# EAGLE design polivoks ambika (EAGLE 6.3)
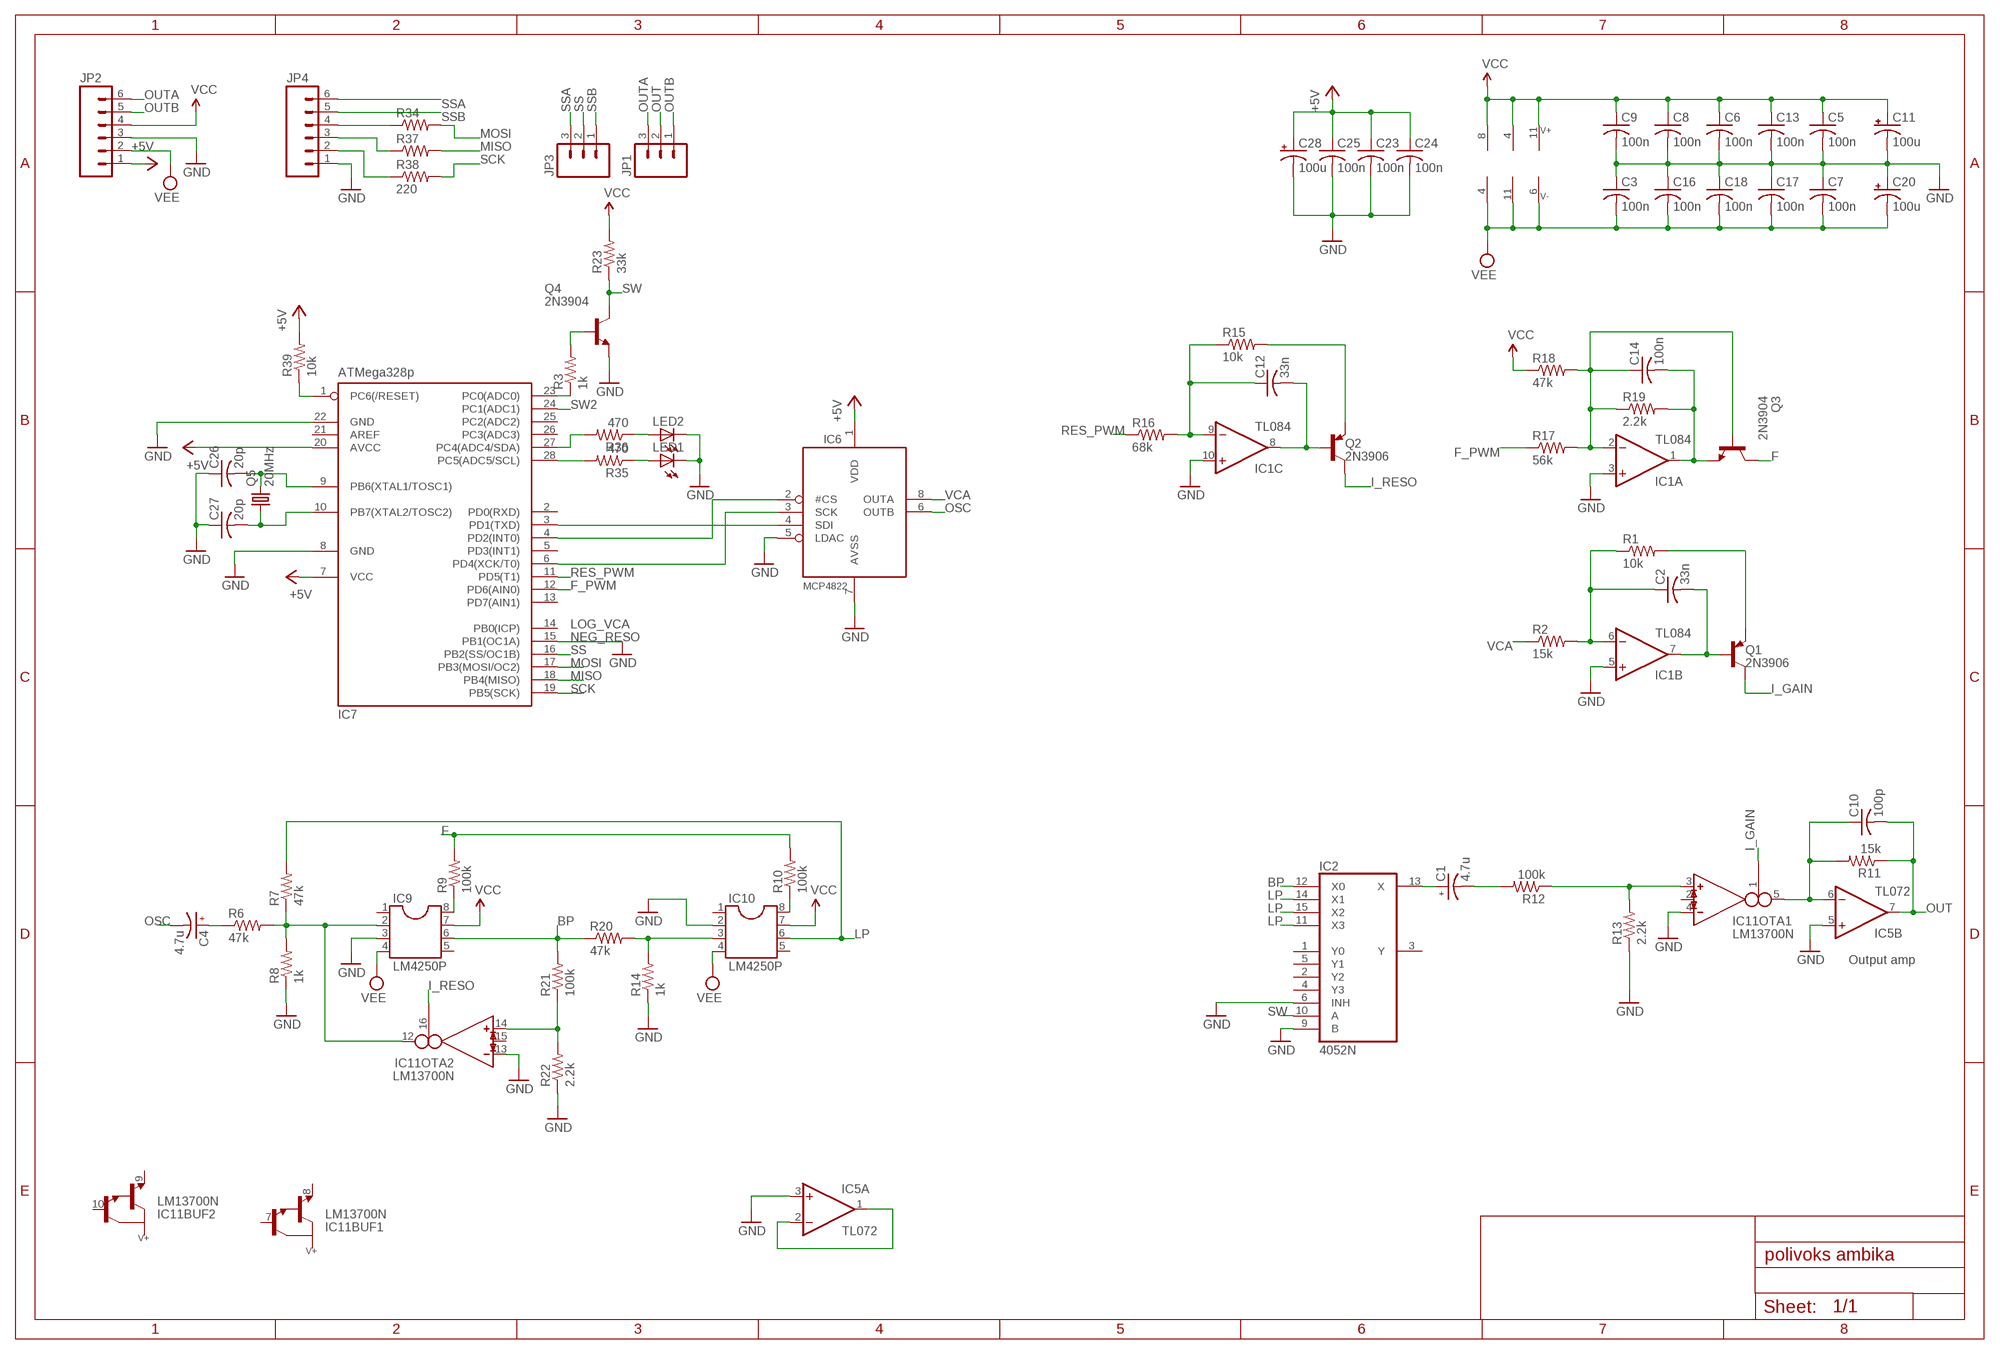
[diagram p0: schematic, sheet 1]

## Parts
C1  4.7u  CPOL-USE11-6.3  [E11-6.3]
C2  33n  C-US050-025X075  [C050-025X075]
C3  100n  C-US025-025X050  [C025-025X050]
C4  4.7u  CPOL-USE11-6.3  [E11-6.3]
C5  100n  C-US025-025X050  [C025-025X050]
C6  100n  C-US025-025X050  [C025-025X050]
C7  100n  C-US025-025X050  [C025-025X050]
C8  100n  C-US025-025X050  [C025-025X050]
C9  100n  C-US025-025X050  [C025-025X050]
C10  100p  C-US025-025X050  [C025-025X050]
C11  100u  CPOL-USE2.5-6  [E2,5-6]
C12  33n  C-US050-025X075  [C050-025X075]
C13  100n  C-US025-025X050  [C025-025X050]
C14  100n  C-US025-025X050  [C025-025X050]
C16  100n  C-US025-025X050  [C025-025X050]
C17  100n  C-US025-025X050  [C025-025X050]
C18  100n  C-US025-025X050  [C025-025X050]
C20  100u  CPOL-USE2.5-6  [E2,5-6]
C23  100n  C-US025-025X050  [C025-025X050]
C24  100n  C-US025-025X050  [C025-025X050]
C25  100n  C-US025-025X050  [C025-025X050]
C26  20p  C-US025-024X044  [C025-024X044]
C27  20p  C-US025-024X044  [C025-024X044]
C28  100u  CPOL-USE2.5-6  [E2,5-6]
IC1  TL084  TL084P  [DIL14]
IC2  4052N  [DIL16]
IC5  TL072  TL082P  [DIL08]
IC6  MCP4822  [DIL08]
IC7  ATMega328p  MEGA8-P  [DIL28-3]
IC9  LM4250P  DIL8  [DIL08]
IC10  LM4250P  DIL8  [DIL08]
IC11  LM13700N  [DIL16]
JP1  M03PTH  [1X03]
JP2  M06SIP  [1X06]
JP3  M03PTH  [1X03]
JP4  M06SIP  [1X06]
LED1  LED3MM  [LED3MM]
LED2  LED3MM  [LED3MM]
Q1  2N3906  2N3906-  [TO92-]
Q2  2N3906  2N3906-  [TO92-]
Q3  2N3904  [TO92]
Q4  2N3904  [TO92]
Q5  20MHz  CRYSTALHC49U-V  [HC49U-V]
R1  10k  R-US_0204/7  [0204/7]
R2  15k  R-US_0204/7  [0204/7]
R3  1k  R-US_0204/7  [0204/7]
R6  47k  R-US_0204/7  [0204/7]
R7  47k  R-US_0204/7  [0204/7]
R8  1k  R-US_0204/7  [0204/7]
R9  100k  R-US_0204/7  [0204/7]
R10  100k  R-US_0204/7  [0204/7]
R11  15k  R-US_0204/7  [0204/7]
R12  100k  R-US_0204/7  [0204/7]
R13  2.2k  R-US_0204/7  [0204/7]
R14  1k  R-US_0204/7  [0204/7]
R15  10k  R-US_0204/7  [0204/7]
R16  68k  R-US_0204/7  [0204/7]
R17  56k  R-US_0204/7  [0204/7]
R18  47k  R-US_0204/7  [0204/7]
R19  2.2k  R-US_0204/7  [0204/7]
R20  47k  R-US_0204/7  [0204/7]
R21  100k  R-US_0204/7  [0204/7]
R22  2.2k  R-US_0204/7  [0204/7]
R23  33k  R-US_0204/7  [0204/7]
R34  220  R-US_0204/7  [0204/7]
R35  470  R-US_0204/7  [0204/7]
R36  470  R-US_0204/7  [0204/7]
R37  220  R-US_0204/7  [0204/7]
R38  220  R-US_0204/7  [0204/7]
R39  10k  R-US_0204/7  [0204/7]

## Nets
+5V: C23.1 C24.1 C25.1 C28.+ IC6.1(VDD) IC7.7(VCC) IC7.20(AVCC) JP2.1 R39.2
BP: IC2.12(X0) IC9.6 R20.1 R21.2
F: Q3.1(C) R9.2 R10.2
F_PWM: IC7.12(PD6(AIN0)) R17.1
GND: C3.1 C5.2 C6.2 C7.1 C8.2 C9.2 C11.- C13.2 C16.1 C17.1 C18.1 C20.+ C23.2 C24.2 C25.2 C26.1 C27.1 C28.- IC1.3(A:+IN) IC1.5(B:+IN) IC1.10(C:+IN) IC2.6(INH) IC2.9(B) IC5.3(A:+IN) IC5.5(B:+IN) IC6.5(LDAC) IC6.7(AVSS) IC7.8(GND) IC7.15(PB1(OC1A)) IC7.22(GND) IC9.3 IC10.2 IC11.4(OTA1:IN_N) IC11.13(OTA2:IN_N) JP2.3 JP4.1 LED1.K(C) LED2.K(C) Q4.3(E) R8.1 R13.1 R14.1 R22.1
I_GAIN: IC11.1(OTA1:I_BIAS) Q1.1(C)
I_RESO: IC11.16(OTA2:I_BIAS) Q2.1(C)
LP: IC2.11(X3) IC2.14(X1) IC2.15(X2) IC10.6 R7.2
MISO: IC7.18(PB4(MISO)) R37.2
MOSI: IC7.17(PB3(MOSI/OC2)) R34.2
N$1: IC9.2 IC11.12(OTA2:OUT) R6.2 R7.1 R8.2
N$2: C14.2 IC1.1(A:OUT) Q3.3(E) R19.2
N$3: IC6.4(SDI) IC7.3(PD1(TXD))
N$4: C4.+ R6.1
N$5: C1.+ IC2.13(X)
N$6: IC10.3 R14.2 R20.2
N$7: LED1.A R35.1
N$8: JP4.2 R38.1
N$9: IC9.8 R9.1
N$10: LED2.A R36.1
N$11: IC7.27(PC4(ADC4/SDA)) R36.2
N$12: C1.- R12.2
N$13: JP4.3 R37.1
N$14: IC7.1(PC6(/RESET)) R39.1
N$15: IC6.3(SCK) IC7.6(PD4(XCK/T0))
N$16: IC6.2(#CS) IC7.4(PD2(INT0))
N$17: IC10.8 R10.1
N$18: JP4.4 R34.1
N$19: IC11.14(OTA2:IN_P) R21.1 R22.2
N$20: IC7.28(PC5(ADC5/SCL)) R35.2
N$21: Q4.2(B) R3.2
N$22: IC5.1(A:OUT) IC5.2(A:-IN)
N$23: IC7.23(PC0(ADC0)) R3.1
N$30: C12.2 IC1.8(C:OUT) Q2.2(B)
N$31: C2.2 IC1.7(B:OUT) Q1.2(B)
N$34: IC11.3(OTA1:IN_P) R12.1 R13.2
N$40: C14.1 IC1.2(A:-IN) Q3.2(B) R17.2 R18.2 R19.1
N$51: C2.1 IC1.6(B:-IN) R1.1 R2.2
N$57: C12.1 IC1.9(C:-IN) R15.1 R16.2
N$60: Q2.3(E) R15.2
N$68: Q1.3(E) R1.2
N$70: C10.1 IC5.6(B:-IN) IC11.5(OTA1:OUT) R11.2
N$82: C27.2 IC7.10(PB7(XTAL2/TOSC2)) Q5.1
N$83: C26.2 IC7.9(PB6(XTAL1/TOSC1)) Q5.2
OSC: C4.- IC6.6(OUTB)
OUT: C10.2 IC5.7(B:OUT) JP1.2 R11.1
OUTA: JP1.3 JP2.6
OUTB: JP1.1 JP2.5
RES_PWM: IC7.11(PD5(T1)) R16.1
SCK: IC7.19(PB5(SCK)) R38.2
SS: IC7.16(PB2(SS/OC1B)) JP3.2
SSA: JP3.3 JP4.6
SSB: JP3.1 JP4.5
SW: IC2.10(A) Q4.1(C) R23.1
SW2: IC7.24(PC1(ADC1))
VCA: IC6.8(OUTA) R2.1
VCC: C5.1 C6.1 C8.1 C9.1 C11.+ C13.1 IC1.4(P:V+) IC5.8(P:V+) IC9.7 IC10.7 IC11.11(SUPPLY:V+) JP2.4 R18.1 R23.2
VEE: C3.2 C7.2 C16.2 C17.2 C18.2 C20.- IC1.11(P:V-) IC5.4(P:V-) IC9.4 IC10.4 IC11.6(SUPPLY:V-) JP2.2
Unconnected: IC1.12(D:+IN) IC1.13(D:-IN) IC1.14(D:OUT) IC2.1(Y0) IC2.2(Y2) IC2.3(Y) IC2.4(Y3) IC2.5(Y1) IC7.2(PD0(RXD)) IC7.5(PD3(INT1)) IC7.13(PD7(AIN1)) IC7.14(PB0(ICP)) IC7.21(AREF) IC7.25(PC2(ADC2)) IC7.26(PC3(ADC3)) IC9.1 IC9.5 IC10.1 IC10.5 IC11.2(OTA1:I_DIODE) IC11.7(BUF1:B) IC11.8(BUF1:E) IC11.9(BUF2:E) IC11.10(BUF2:B) IC11.15(OTA2:I_DIODE)

## Notes on the sheet
- LOG_VCA
- NEG_RESO
- Output amp

## Power pins joined to a net without a drawn wire
GND: IC2.8(GND)
VCC: IC2.16(VCC)
VEE: IC2.7(VEE)

## Library data of the parts
C1 C4 = og-rcl:CPOL-US
C2 C3 C5-C10 C12-C14 C16-C18 C23-C27 = rcl:C-US: CAPACITOR, American symbol
C11 C20 C28 = rcl:CPOL-US: POLARIZED CAPACITOR, American symbol
IC1 = linear:TL084: OP AMP
IC2 = 40xx:4052: Dual 4-channel ANALOG MULTIPLEXER
IC5 = linear:TL082: OP AMP
IC6 = og-dac:MCP4822
IC7 = atmel:MEGA8-P: MICROCONTROLLER 8 Kbytes FLASH, 1 kbytes SRAM, 512 bytes EEPROM, USART, 4-channel 10 bit ADC, 2-channel 8 bit ADC Pin compatible with Atmega48, ATMega88, ATMega168 Source: avr.lbr; OC_FARNELL: unknown; OC_NEWARK: unknown
IC9 IC10 = ic-package:DIL8: Dual In Line / Socket
IC11 = ota:LM13700: Dual OTA with buffers
JP1 JP3 = SparkFun:M03: Header 3 Standard 3-pin 0.1" header. Use with straight break away headers (SKU : PRT-00116), right angle break away headers (PRT-00553), swiss pins (PRT-00743), machine pins (PRT-00117), and female headers (PRT-00115). Molex polarized connector foot print use with SKU : PRT-08232 with associated crimp pins and housings.
JP2 JP4 = SparkFun:M06: Header 6 Standard 6-pin 0.1" header. Use with straight break away headers (SKU : PRT-00116), right angle break away headers (PRT-00553), swiss pins (PRT-00743), machine pins (PRT-00117), and female headers (PRT-00115). Molex polarized connector foot print use with SKU : PRT-08094 with associated crimp pins and housings. NOTES ON THE VARIANTS LOCK and LOCK_LONGPADS... This footprint was designed to help hold the alignment of a through-hole component (i.e. 6-pin header) while soldering it into place. You may notice that each hole has been shifted either up or down by 0.005 of an inch from it's more standard position (which is a perfectly straight line). This slight alteration caused the pins (the squares in the middle) to touch the edges of the holes. Because they are alternating, it causes a "brace" to hold the component in place. 0.005 has proven to be the perfect amount of "off-center" position when using our standard breakaway headers. Although looks a little odd when you look at the bare footprint, once you have a header in there, the alteration is very hard to notice. Also, if you push a header all the way into place, it is covered up entirely on the bottom side. This idea of altering the position of holes to aid alignment will be further integrated into the Sparkfun Library for other footprints. It can help hold any component with 3 or more connection pins.
LED1 LED2 = led:LED: LED OSRAM: - CHIPLED LG R971, LG N971, LY N971, LG Q971, LY Q971, LO R971, LY R971 LH N974, LH R974 LS Q976, LO Q976, LY Q976 LO Q996 - Hyper CHIPLED LW Q18S LB Q993, LB Q99A, LB R99A - SideLED LS A670, LO A670, LY A670, LG A670, LP A670 LB A673, LV A673, LT A673, LW A673 LH A674 LY A675 LS A676, LA A676, LO A676, LY A676, LW A676 LS A679, LY A679, LG A679 - Hyper Micro SIDELED® LS Y876, LA Y876, LO Y876, LY Y876 LT Y87S - SmartLED LW L88C, LW L88S LB L89C, LB L89S, LG L890 LS L89K, LO L89K, LY L89K LS L896, LA L896, LO L896, LY L896 - TOPLED LS T670, LO T670, LY T670, LG T670, LP T670 LSG T670, LSP T670, LSY T670, LOP T670, LYG T670 LG T671, LOG T671, LSG T671 LB T673, LV T673, LT T673, LW T673 LH T674 LS T676, LA T676, LO T676, LY T676, LB T676, LH T676, LSB T676, LW T676 LB T67C, LV T67C, LT T67C, LS T67K, LO T67K, LY T67K, LW E67C LS E67B, LA E67B, LO E67B, LY E67B, LB E67C, LV E67C, LT E67C LW T67C LS T679, LY T679, LG T679 LS T770, LO T770, LY T770, LG T770, LP T770 LB T773, LV T773, LT T773, LW T773 LH T774 LS E675, LA E675, LY E675, LS T675 LS T776, LA T776, LO T776, LY T776, LB T776 LHGB T686 LT T68C, LB T68C - Hyper Mini TOPLED® LB M676 - Mini TOPLED Santana® LG M470 LS M47K, LO M47K, LY M47K Source: http://www.osram.convergy.de LUXEON: - LUMILED® LXK2-PW12-R00, LXK2-PW12-S00, LXK2-PW14-U00, LXK2-PW14-V00 LXK2-PM12-R00, LXK2-PM12-S00, LXK2-PM14-U00 LXK2-PE12-Q00, LXK2-PE12-R00, LXK2-PE12-S00, LXK2-PE14-T00, LXK2-PE14-U00 LXK2-PB12-K00, LXK2-PB12-L00, LXK2-PB12-M00, LXK2-PB14-N00, LXK2-PB14-P00, LXK2-PB14-Q00 LXK2-PR12-L00, LXK2-PR12-M00, LXK2-PR14-Q00, LXK2-PR14-R00 LXK2-PD12-Q00, LXK2-PD12-R00, LXK2-PD12-S00 LXK2-PH12-R00, LXK2-PH12-S00 LXK2-PL12-P00, LXK2-PL12-Q00, LXK2-PL12-R00 Source: www.luxeon.com KINGBRIGHT: KA-3528ASYC Source: www.kingbright.com
Q1 Q2 = gm-trans:2N3906: PNP Transistor
Q3 Q4 = transistor:2N3904: NPN TRANSISTOR
Q5 = crystal:CRYSTAL: CRYSTAL; OC_FARNELL: 1666969; OC_NEWARK: unknown
R1-R3 R6-R23 R34-R39 = rcl:R-US_: RESISTOR, American symbol

## Board
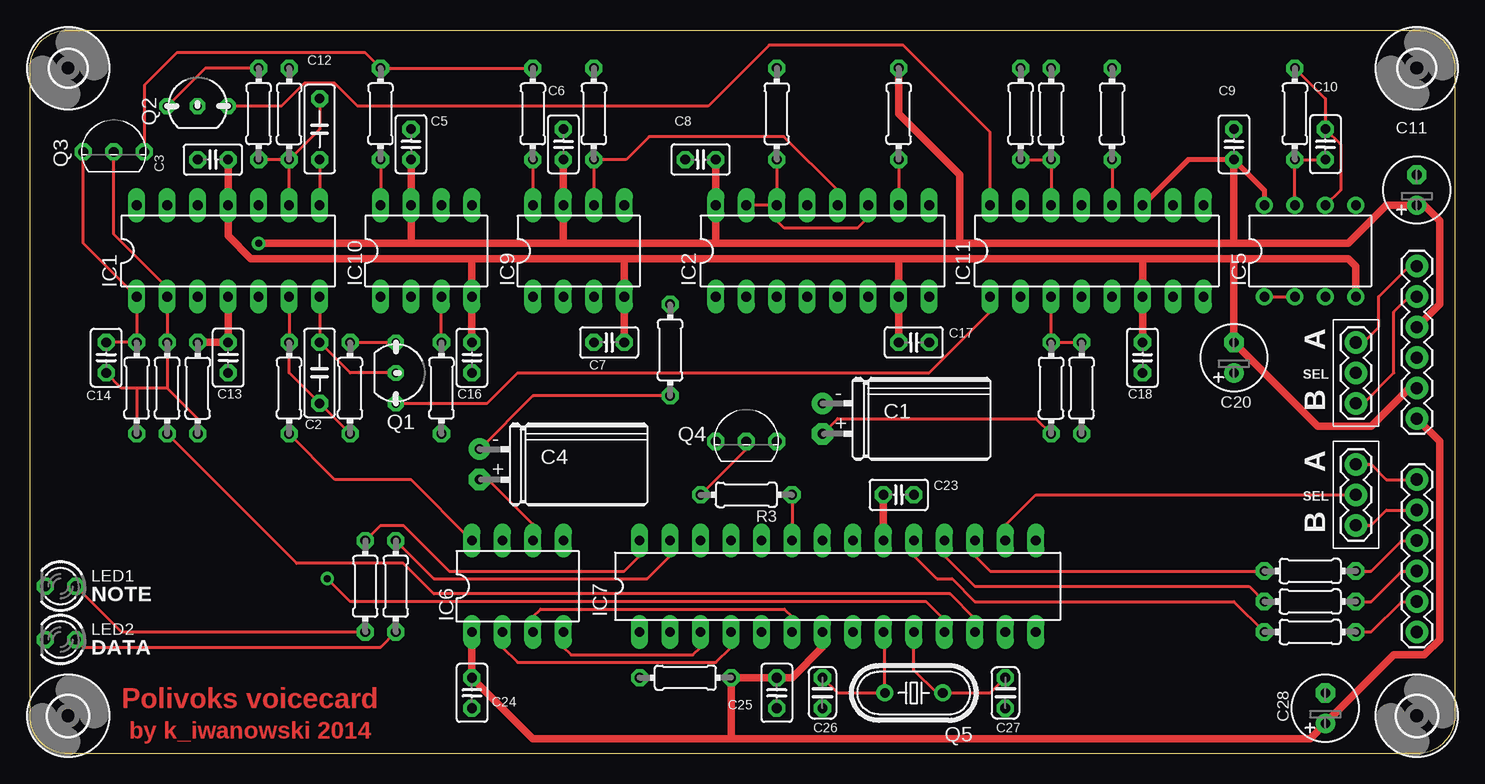
[diagram p1: board, top side]
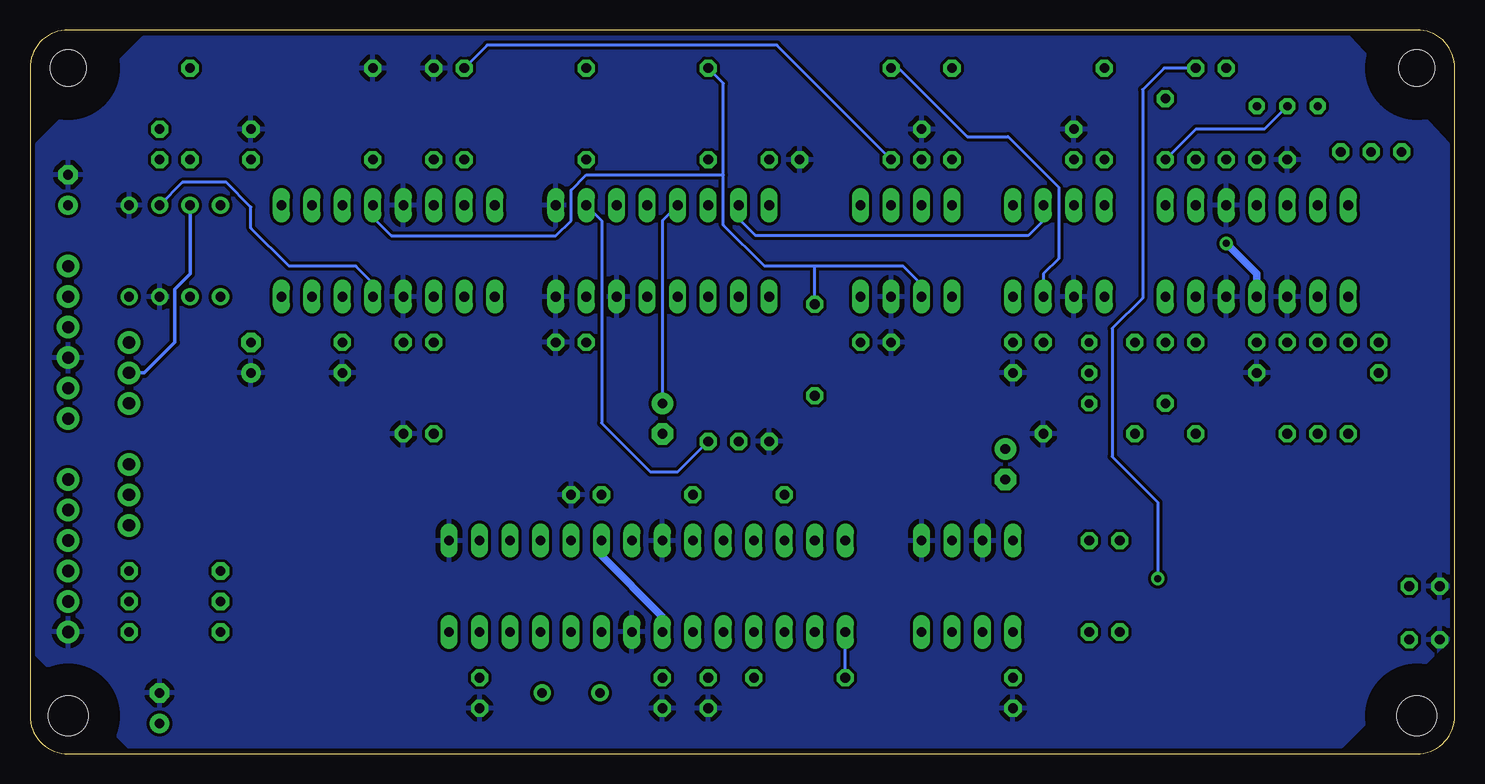
[diagram p2: board, bottom side, seen from below]

Size 118.75 x 60.33 mm. Coordinates in mm from the lower left corner, seen from the top.
Outline: 0,57.15 arc-90 3.17,60.33 115.57,60.33 arc-90 118.75,57.15 118.75,3.17 arc-90 115.57,0 3.17,0 arc-90 0,3.17 0,57.15
Copper layers (1*16): Top 0.035mm / dielectric 1.5mm / Bottom 0.035mm
Design rules "SparkFun *": minimum track width 8mil, minimum drill 20mil, track to track 8mil, track to pad 8mil, pad to pad 8mil, via to via 8mil, smd to smd 8mil, copper to edge 10mil, drill to drill 8mil, minimum pad ring 12mil, minimum via ring 10mil, stop-mask expansion 4mil, vias tented up to drill 25mil, thermal gap 16mil

### Footprints (pad centres in the part's own frame; a part is rotated, then mirrored left to right if it is on the bottom)
E11-6.3 = drill 0.813 pad 1.778: + -2.54,1.27 | drill 0.813 pad 1.778 octagon: - -2.54,-1.27
C050-025X075 = drill 0.813 octagon: 1 -2.54,0; 2 2.54,0
C025-025X050 = drill 0.813 octagon: 1 -1.27,0; 2 1.27,0
E2,5-6 = drill 0.813 pad 1.6: + -1.27,0 | drill 0.813 pad 1.6 octagon: - 1.27,0
C025-024X044 = drill 0.813 octagon: 1 -1.27,0; 2 1.27,0
DIL14 = drill 0.813 long: 1 -7.62,-3.81; 2 -5.08,-3.81; 3 -2.54,-3.81; 4 0,-3.81; 5 2.54,-3.81; 6 5.08,-3.81; 7 7.62,-3.81; 8 7.62,3.81; 9 5.08,3.81; 10 2.54,3.81; 11 0,3.81; 12 -2.54,3.81; 13 -5.08,3.81; 14 -7.62,3.81
DIL16 = drill 0.813 long: 1 -8.89,-3.81; 2 -6.35,-3.81; 3 -3.81,-3.81; 4 -1.27,-3.81; 5 1.27,-3.81; 6 3.81,-3.81; 7 6.35,-3.81; 8 8.89,-3.81; 9 8.89,3.81; 10 6.35,3.81; 11 3.81,3.81; 12 1.27,3.81; 13 -1.27,3.81; 14 -3.81,3.81; 15 -6.35,3.81; 16 -8.89,3.81
DIL08 = drill 0.813 pad 1.27: 1 -3.81,-3.81; 2 -1.27,-3.81; 3 1.27,-3.81; 4 3.81,-3.81; 5 3.81,3.81; 6 1.27,3.81; 7 -1.27,3.81; 8 -3.81,3.81
DIL08' = drill 0.813 long: 1 -3.81,-3.81; 2 -1.27,-3.81; 3 1.27,-3.81; 4 3.81,-3.81; 5 3.81,3.81; 6 1.27,3.81; 7 -1.27,3.81; 8 -3.81,3.81
DIL28-3 = drill 0.813 long: 1 -16.51,-3.81; 2 -13.97,-3.81; 3 -11.43,-3.81; 4 -8.89,-3.81; 5 -6.35,-3.81; 6 -3.81,-3.81; 7 -1.27,-3.81; 8 1.27,-3.81; 9 3.81,-3.81; 10 6.35,-3.81; 11 8.89,-3.81; 12 11.43,-3.81; 13 13.97,-3.81; 14 16.51,-3.81; 15 16.51,3.81; 16 13.97,3.81; 17 11.43,3.81; 18 8.89,3.81; 19 6.35,3.81; 20 3.81,3.81; 21 1.27,3.81; 22 -1.27,3.81; 23 -3.81,3.81; 24 -6.35,3.81; 25 -8.89,3.81; 26 -11.43,3.81; 27 -13.97,3.81; 28 -16.51,3.81
1X03 = drill 1.016 pad 1.88: 1 0,0; 2 2.54,0; 3 5.08,0
1X06 = drill 1.016 pad 1.88: 1 0,0; 2 2.54,0; 3 5.08,0; 4 7.62,0; 5 10.16,0; 6 12.7,0
LED3MM = drill 0.813 octagon: A -1.27,0; K 1.27,0
TO92- = drill 0.7 octagon: 1 2.54,0; 2 0,0; 3 -2.54,0
TO92 = drill 0.813 octagon: 1 2.54,0; 2 0,0; 3 -2.54,0
HC49U-V = drill 0.813: 1 -2.413,0; 2 2.413,0
0204/7 = drill 0.813 octagon: 1 -3.81,0; 2 3.81,0
3,0 = hole 3: 0,0
3,3 = hole 3.3: 0,0

### Placement (x,y rotation side)
C1  68.58,27.94 0 top
C2  24.13,31.75 90 top
C3  15.24,49.53 0 top
C4  40.01,24.13 0 top
C5  31.75,50.8 90 top
C6  44.45,50.8 90 top
C7  48.26,34.29 0 top
C8  55.88,49.53 180 top
C9  100.33,50.8 90 top
C10  107.95,50.8 270 top
C11  115.57,46.99 90 top
C12  24.13,52.07 270 top
C13  16.51,33.02 270 top
C14  6.35,33.02 90 top
C16  36.83,33.02 90 top
C17  73.66,34.29 180 top
C18  92.71,33.02 90 top
C20  100.33,33.02 90 top
C23  72.39,21.59 0 top
C24  36.83,5.08 270 top
C25  62.23,5.08 270 top
C26  66.04,5.08 90 top
C27  81.28,5.08 90 top
C28  107.95,3.81 90 top
IC1  16.51,41.91 0 top
IC2  66.04,41.91 0 top
IC5  106.68,41.91 0 top
IC6  MCP4822  [DIL08']  40.64,13.97 0 top
IC7  67.31,13.97 0 top
IC9  LM4250P  [DIL08']  45.72,41.91 0 top
IC10  LM4250P  [DIL08']  33.02,41.91 0 top
IC11  88.9,41.91 0 top
JP1  110.49,29.21 90 top
JP2  115.57,27.94 90 top
JP3  110.49,19.05 90 top
JP4  115.57,10.16 90 top
LED1  2.54,13.97 180 top
LED2  2.54,9.53 180 top
Q1  30.48,31.75 270 top
Q2  13.97,53.98 0 top
Q3  6.99,50.17 0 top
Q4  59.69,26.04 0 top
Q5  73.66,5.08 180 top
R1  26.67,30.48 90 top
R2  21.59,30.48 90 top
R3  59.69,21.59 180 top
R6  53.34,33.66 90 top
R7  62.23,53.34 270 top
R8  90.17,53.34 270 top
R9  41.91,53.34 90 top
R10  29.21,53.34 90 top
R11  105.41,53.34 90 top
R12  85.09,30.48 270 top
R13  87.63,30.48 90 top
R14  34.29,30.48 90 top
R15  19.05,53.34 90 top
R16  21.59,53.34 270 top
R17  11.43,30.48 90 top
R18  13.97,30.48 270 top
R19  8.89,30.48 90 top
R20  46.99,53.34 90 top
R21  82.55,53.34 90 top
R22  85.09,53.34 270 top
R23  72.39,53.34 90 top
R34  106.68,15.24 180 top
R35  27.94,13.97 90 top
R36  30.48,13.97 90 top
R37  106.68,12.7 180 top
R38  106.68,10.16 180 top
R39  54.61,6.35 0 top
U$1  [3,0]  3.17,57.15 0 top
U$2  [3,0]  115.57,57.15 0 top
U$4  [3,3]  3.17,3.17 0 top
U$5  [3,3]  115.57,3.17 0 top

### Tracks (layer width: path | path; a pad name or v marks a point on that pad's centre or on a via)
+5V
  Top 0.61: 58.42,1.27 41.91,1.27 C24.1 IC6.1 | 58.42,1.27 106.68,1.27 C28.+ 113.67,8.26 116.2,8.26 117.47,9.53 117.47,26.04 JP2.1 | 58.42,1.27 R39.2 C25.1 63.5,6.35 66.04,8.89 IC7.7 | IC7.20 C23.1
  Bottom 0.61: IC7.7 66.04,11.43 71.12,16.51 IC7.20
BP
  Top 0.254: IC9.6 R20.1 49.68,49.53 51.59,51.44 62.83,51.44 67.31,46.95 IC2.12
  Bottom 0.254: R20.1 56.52,59.05 80.64,59.05 R21.2
F
  Top 0.254: R9.2 R10.2 27.94,58.42 12.22,58.42 9.53,55.73 Q3.1
F_PWM
  Top 0.254: IC7.12 78.74,11.28 76.69,13.33 33.66,13.33 31.11,15.88 22.23,15.88 R17.1
GND
  pour Bottom (isolate 0.254): 8.89,59.69 0.64,50.8 0.64,9.53 9.53,0.64 110.49,0.64 118.11,8.26 118.11,50.8 109.22,59.69
I_GAIN
  Top 0.254: Q1.1 38.1,29.21 40.64,31.75 74.93,31.75 80.01,36.83 IC11.1
I_RESO
  Top 0.254: IC11.16 80.01,51.82 72.77,59.05 61.59,59.05 56.52,53.98 27.3,53.98 25.4,55.88 22.86,55.88 20.95,53.98 Q2.1
LP
  Top 0.254: IC2.11 69.85,44.71 68.95,43.82 62.87,43.82 62.23,44.45 IC2.14 | IC2.14 IC2.15 | R7.2 IC2.14
  Bottom 0.254: IC10.6 34.29,44.45 35.56,43.18 58.27,43.18 59.69,44.6 IC2.15
MISO
  Top 0.254: R37.2 101.6,13.97 78.74,13.97 76.2,16.51 IC7.18
MOSI
  Top 0.254: R34.2 80.01,15.24 78.74,16.51 IC7.17
N$1
  Top 0.254: R8.2 IC11.12
  Bottom 0.254: IC11.12 90.17,44.71 88.64,43.18 74.93,43.18 73.66,44.45 73.66,46.99 72.39,48.26 60.96,48.26 | 60.96,48.26 60.96,55.88 R7.1 | IC9.2 44.45,39.11 45.98,40.64 53.34,40.64 | 53.34,40.64 57.53,40.64 60.96,44.07 60.96,48.26 | R6.2 53.34,40.64
N$2
  Top 0.254: C14.2 R19.2 IC1.1 4.45,42.55 Q3.3
N$3
  Top 0.254: IC7.3 55.88,8.89 55.24,8.26 45.09,8.26 44.45,8.89 IC6.4
N$4
  Top 0.254: R6.1 41.91,29.84 C4.+
N$5
  Bottom 0.254: IC2.13 66.04,44.45 C1.+
N$6
  Top 0.254: R14.2 IC10.3
  Bottom 0.254: R20.2 46.35,57.15 40.64,51.44 37.23,51.44 33.02,47.23 33.02,41.28 34.29,40.01 IC10.3
N$7
  Top 0.254: R35.1 7.62,10.16 LED1.A
N$8
  Top 0.254: R38.1 111.76,10.16 114.3,12.7 JP4.2
N$9
  Top 0.254: R9.1 IC9.8
N$10
  Top 0.254: R36.1 29.21,8.89 4.45,8.89 LED2.A
N$11
  Top 0.254: R36.2 33.66,14.61 51.44,14.61 53.34,16.51 IC7.27
N$12
  Top 0.254: C1.- 67.31,27.94 83.82,27.94 R12.2
N$13
  Top 0.254: R37.1 111.76,12.7 114.3,15.24 JP4.3
N$14
  Bottom 0.254: R39.1 IC7.1
N$15
  Top 0.254: IC7.6 63.5,11.43 62.87,12.06 42.55,12.06 41.91,11.43 IC6.3
N$16
  Top 0.254: IC7.4 58.42,8.89 57.15,7.62 40.64,7.62 39.37,8.89 IC6.2
N$17
  Top 0.254: R10.1 IC10.8
N$18
  Top 0.254: R34.1 111.76,15.24 114.3,17.78 JP4.4
N$19
  Top 0.254: IC11.14 R22.2 R21.1
N$20
  Top 0.254: R35.2 29.21,19.05 31.11,19.05 34.92,15.24 49.53,15.24 50.8,16.51 IC7.28
N$21
  Top 0.254: R3.2 59.69,25.4 Q4.2
N$22
  Top 0.254: IC5.1 IC5.2
N$23
  Top 0.254: R3.1 IC7.23
N$30
  Top 0.254: C12.2 IC1.8
  Bottom 0.254: Q2.2 15.88,52.07 21.59,52.07 C12.2
N$31
  Top 0.254: IC1.7 C2.2 26.67,31.75 Q1.2
N$34
  Top 0.254: R13.2 R12.1 IC11.3
N$40
  Top 0.254: 11.43,30.48 R17.2 IC1.2 11.43,38.84 9.63,40.64 6.99,43.29 Q3.2 | 11.43,30.48 8.89,30.48 | 8.89,30.48 R19.1 | 11.43,30.48 13.97,27.94 R18.2 | 8.89,30.48 7.62,30.48 C14.1
N$51
  Top 0.254: IC1.6 R2.2 21.59,31.75 C2.1 R1.1
N$57
  Top 0.254: IC1.9 R16.2 | R16.2 R15.1 | C12.1 24.13,52.07 R16.2
N$60
  Top 0.254: R15.2 14.61,57.15 Q2.3
N$68
  Top 0.254: R1.2 Q1.3
N$70
  Top 0.254: R11.2 107.95,54.61 C10.1 109.22,50.8 109.22,46.99 IC5.6
  Bottom 0.254: IC5.6 106.05,47.62 102.39,47.62 100.33,45.57 100.33,43.82 97.16,40.64 91.59,40.64 90.17,39.22 IC11.5
N$82
  Top 0.254: IC7.10 73.66,6.98 75.56,5.08 Q5.1 80.01,5.08 C27.2
N$83
  Top 0.254: IC7.9 71.25,10.03 Q5.2 67.31,5.08 C26.2
OSC
  Top 0.254: IC6.6 41.91,19.16 38.21,22.86 C4.-
OUT
  Top 0.254: C10.2 R11.1 IC5.7
  Bottom 0.305: IC5.7 105.41,40.01 106.68,38.74 106.68,34.29 109.22,31.75 JP1.2
OUTA
  Top 0.254: JP1.3 111.12,34.29 112.39,35.56 112.39,38.1 114.94,40.64 JP2.6
OUTB
  Top 0.254: JP1.1 111.12,29.21 113.67,31.75 113.67,36.83 114.94,38.1 JP2.5
RES_PWM  (via drill 0.6)
  Top 0.254: IC7.11 76.2,11.17 74.67,12.7 26.67,12.7 v24.77,14.61
  Bottom 0.254: R16.1 24.24,57.15 26.04,55.35 26.04,37.99 28.57,35.45 28.57,24.77 24.77,20.95 v24.77,14.61
SCK
  Top 0.254: R38.2 100.33,12.7 78.74,12.7 76.83,14.61 75.56,14.61 73.66,16.51 IC7.19
SS
  Top 0.254: JP3.2 83.82,21.59 81.28,19.05 IC7.16
SSA
  Top 0.254: JP3.3 111.76,24.13 113.03,22.86 JP4.6
SSB
  Top 0.254: JP3.1 111.76,19.05 113.03,20.32 JP4.5
SW
  Top 0.254: R23.1 IC2.10
  Bottom 0.254: IC2.10 71.12,44.45 71.12,27.56 67.05,23.5 64.77,23.5 Q4.1
VCA
  Top 0.254: IC6.8 31.75,22.86 25.4,22.86 R2.1
VCC  (via drill 0.6)
  Top 0.406: IC11.11 96.52,49.53 C9.1 102.87,46.99 IC5.8
  Top 0.61: JP2.4 117.47,37.47 117.47,44.45 116.2,45.72 C11.+ 113.03,45.72 109.86,42.55 100.33,42.55 | v19.05,42.55 31.75,42.55 | 31.75,42.55 44.45,42.55 | 44.45,42.55 57.15,42.55 | 57.15,42.55 77.47,42.55 | IC1.4 C13.1 R18.1 | 77.47,42.55 100.33,42.55 | 31.75,42.55 IC10.7 C5.1 | C6.1 IC9.7 44.45,42.55 | C8.1 IC2.16 57.15,42.55 | 77.47,42.55 77.47,48.26 72.39,53.34 R23.2 | 100.33,42.55 C9.1
  Bottom 0.61: v19.05,42.55 16.51,40.01 IC1.4
VEE
  Top 0.61: 100.33,41.28 92.71,41.28 | 92.71,41.28 72.39,41.28 | 72.39,41.28 49.53,41.28 | 49.53,41.28 36.83,41.28 | 36.83,41.28 18.41,41.28 16.51,43.18 IC1.11 C3.2 | JP2.2 114.94,30.48 111.76,27.3 107.31,27.3 C20.- 100.33,41.28 | IC5.4 110.49,40.64 109.86,41.28 100.33,41.28 | C16.2 IC10.4 36.83,41.28 | C7.2 IC9.4 49.53,41.28 | 72.39,41.28 IC2.7 C17.2 | C18.2 IC11.6 92.71,41.28

### Text on the board
Top: Polivoks voicecard | by k_iwanowski 2014
tNames: A | SEL | B | A | SEL | B | NOTE | DATA
tStop: Polivoks voicecard | by k_iwanowski 2014